# EAGLE schematic currentmeasurement (EAGLE 9.5.1)
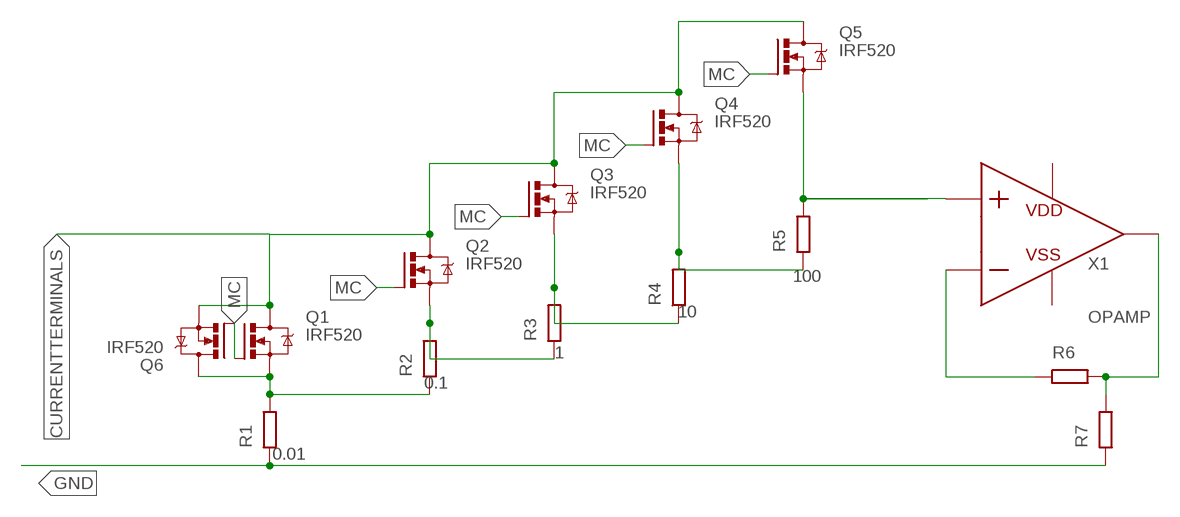
[diagram p0: schematic, sheet 1]

## Parts
Q1  IRF520  [TO220BV]
Q2  IRF520  [TO220BV]
Q3  IRF520  [TO220BV]
Q4  IRF520  [TO220BV]
Q5  IRF520  [TO220BV]
Q6  IRF520  [TO220BV]
R1  R  (no package)
R2  R  (no package)
R3  R  (no package)
R4  R  (no package)
R5  R  (no package)
R6  R  (no package)
R7  R  (no package)
X1  OPAMP  (no package)

## Nets
CURRENTTERMINALS: Q1.D Q2.D Q3.D Q4.D Q5.D Q6.S
GND: R1.1 R7.1
MC: Q1.G Q2.G Q3.G Q4.G Q5.G Q6.G
N$1: R6.1 X1.N
N$2: Q1.S Q6.D R1.2 R2.1
N$4: Q2.S R2.2 R3.1
N$5: Q3.S R3.2 R4.1
N$6: Q4.S R4.2 R5.1
N$7: Q5.S R5.2 X1.P
N$8: R6.2 R7.2 X1.VOUT
Unconnected: X1.VDD X1.VSS

## Library data of the parts
Q1-Q6 = transistor-power:IRF520: HEXFET Power MOSFET
R1 = ngspice-simulation:R: RESISTOR; R1: 0.01
R2 = ngspice-simulation:R: RESISTOR; R2: 0.1
R3 = ngspice-simulation:R: RESISTOR; R3: 1
R4 = ngspice-simulation:R: RESISTOR; R4: 10
R5 = ngspice-simulation:R: RESISTOR; R5: 100
R6 R7 = ngspice-simulation:R: RESISTOR
X1 = ngspice-simulation:OPAMP: Operational amplifier with power pins